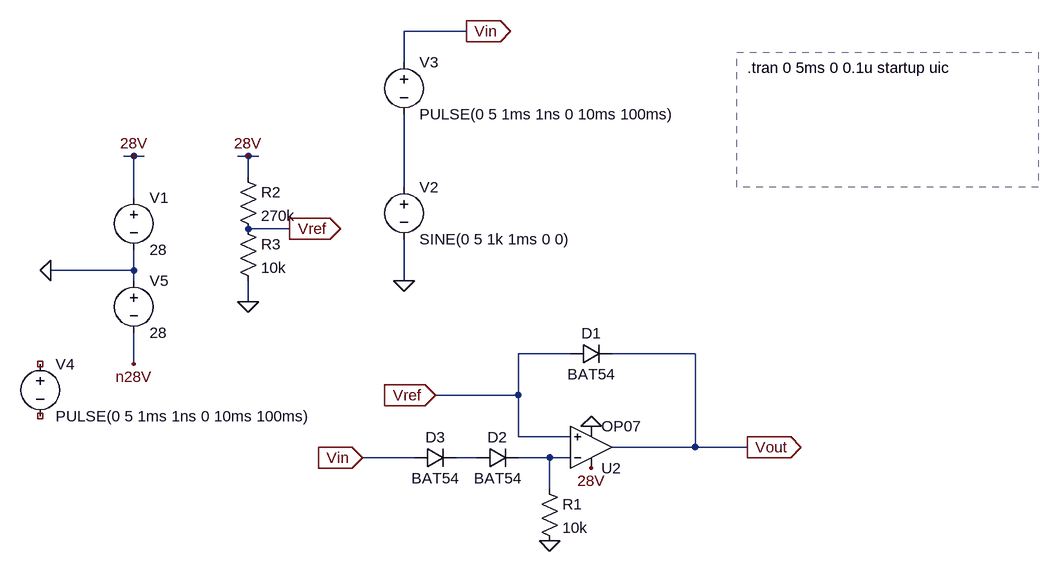
[diagram p0: schematic sim.asc]
sim.asc, the LTspice schematic file:
Version 4.1
SHEET 1 880 680
WIRE -32 -448 -128 -448
WIRE -128 -400 -128 -448
WIRE -544 -256 -560 -256
WIRE -528 -256 -544 -256
WIRE -368 -256 -384 -256
WIRE -352 -256 -368 -256
WIRE -368 -224 -368 -256
WIRE -128 -208 -128 -320
WIRE -544 -192 -544 -256
WIRE -304 -144 -368 -144
WIRE -544 -80 -544 -112
WIRE -544 -80 -672 -80
WIRE -544 -64 -544 -80
WIRE -128 -64 -128 -128
WIRE -368 -32 -368 -64
WIRE 128 48 48 48
WIRE 320 48 192 48
WIRE -544 64 -544 16
WIRE 48 112 48 48
WIRE 48 112 -80 112
WIRE 48 176 48 112
WIRE 128 176 48 176
WIRE 320 192 320 48
WIRE 320 192 192 192
WIRE 400 192 320 192
WIRE -112 208 -192 208
WIRE -16 208 -48 208
WIRE 96 208 48 208
WIRE 128 208 96 208
WIRE 96 256 96 208
FLAG 160 160 0
FLAG -672 -80 0
FLAG -544 -256 28V
FLAG 160 224 28V
FLAG 96 336 0
FLAG -368 -32 0
FLAG -368 -256 28V
FLAG -80 112 Vref
IOPIN -80 112 In
FLAG -192 208 Vin
IOPIN -192 208 In
FLAG 400 192 Vout
IOPIN 400 192 Out
FLAG -128 -64 0
FLAG -32 -448 Vin
IOPIN -32 -448 Out
FLAG -304 -144 Vref
IOPIN -304 -144 Out
FLAG -544 64 n28V
SYMBOL diode 128 64 R270
WINDOW 0 32 32 VTop 2
WINDOW 3 0 32 VBottom 2
SYMATTR InstName D1
SYMATTR Value BAT54
SYMATTR Description Diode
SYMATTR Type diode
SYMBOL voltage -544 -208 R0
WINDOW 123 0 0 Left 0
WINDOW 39 0 0 Left 0
SYMATTR InstName V1
SYMATTR Value 28
SYMBOL diode -16 224 R270
WINDOW 0 32 32 VTop 2
WINDOW 3 0 32 VBottom 2
SYMATTR InstName D2
SYMATTR Value BAT54
SYMATTR Description Diode
SYMATTR Type diode
SYMBOL diode -112 224 R270
WINDOW 0 32 32 VTop 2
WINDOW 3 0 32 VBottom 2
SYMATTR InstName D3
SYMATTR Value BAT54
SYMATTR Description Diode
SYMATTR Type diode
SYMBOL res 80 240 R0
SYMATTR InstName R1
SYMATTR Value 10k
SYMBOL res -384 -240 R0
SYMATTR InstName R2
SYMATTR Value 270k
SYMBOL res -384 -160 R0
SYMATTR InstName R3
SYMATTR Value 10k
SYMBOL voltage -128 -224 R0
WINDOW 123 0 0 Left 0
WINDOW 39 0 0 Left 0
SYMATTR InstName V2
SYMATTR Value SINE(0 5 1k 1ms 0 0)
SYMBOL OpAmps\\OP07 160 256 M180
SYMATTR InstName U2
SYMBOL voltage -128 -416 R0
WINDOW 123 0 0 Left 0
WINDOW 39 0 0 Left 0
SYMATTR InstName V3
SYMATTR Value PULSE(0 5 1ms 1ns 0 10ms 100ms)
SYMBOL voltage -688 48 R0
WINDOW 123 0 0 Left 0
WINDOW 39 0 0 Left 0
SYMATTR InstName V4
SYMATTR Value PULSE(0 5 1ms 1ns 0 10ms 100ms)
SYMBOL voltage -544 -80 R0
WINDOW 123 0 0 Left 0
WINDOW 39 0 0 Left 0
SYMATTR InstName V5
SYMATTR Value 28
TEXT 400 -392 Left 2 !.tran 0 5ms 0 0.1u startup uic
RECTANGLE Normal 848 -208 384 -416 2

The netlist it stands for:
* sim.asc
D1 Vref Vout BAT54
V1 28V 0 28
D2 N002 N003 BAT54
D3 Vin N002 BAT54
R1 N003 0 10k
R2 28V Vref 270k
R3 Vref 0 10k
V2 N001 0 SINE(0 5 1k 1ms 0 0)
X§U2 Vref N003 28V 0 Vout LT1001  ; OP07, pins In+ In- V+ V- OUT
V3 Vin N001 PULSE(0 5 1ms 1ns 0 10ms 100ms)
V4 NC_01 NC_02 PULSE(0 5 1ms 1ns 0 10ms 100ms)
V5 0 n28V 28
.model D D
.lib standard.dio
.tran 0 5ms 0 0.1u startup uic
.lib LTC.lib
.backanno
.end